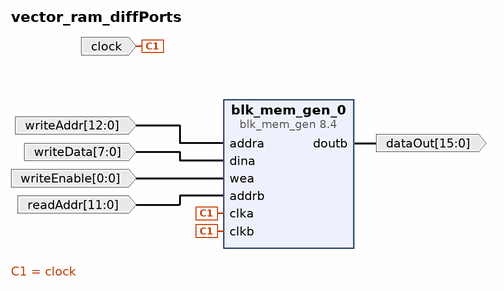
[diagram p0: block diagram of the top level]
# Vivado block design vector_ram_diffPorts, xc7a100tcsg324-1, Vivado 2020.2
create_bd_design vector_ram_diffPorts

create_bd_port -dir I -from 12 -to 0 writeAddr
create_bd_port -dir I -from 7 -to 0 writeData
create_bd_port -dir I -from 0 -to 0 writeEnable
create_bd_port -dir I clock
create_bd_port -dir I -from 11 -to 0 readAddr
create_bd_port -dir O -from 15 -to 0 dataOut

create_bd_cell -type ip -vlnv xilinx.com:ip:blk_mem_gen:8.4 blk_mem_gen_0
set_property -dict [list \
  CONFIG.Coe_File ../../../../../../../avg_clean2.coe \
  CONFIG.Enable_32bit_Address false \
  CONFIG.Enable_A Always_Enabled \
  CONFIG.Enable_B Always_Enabled \
  CONFIG.Fill_Remaining_Memory_Locations true \
  CONFIG.Load_Init_File true \
  CONFIG.Memory_Type Simple_Dual_Port_RAM \
  CONFIG.Operating_Mode_A NO_CHANGE \
  CONFIG.Port_B_Clock 100 \
  CONFIG.Port_B_Enable_Rate 100 \
  CONFIG.Read_Width_B 16 \
  CONFIG.Register_PortB_Output_of_Memory_Primitives true \
  CONFIG.Use_Byte_Write_Enable false \
  CONFIG.Write_Depth_A 8192 \
  CONFIG.Write_Width_A 8 \
  CONFIG.Write_Width_B 16 \
  CONFIG.use_bram_block Stand_Alone \
] [get_bd_cells blk_mem_gen_0]

# ---- connections ----

connect_bd_net [get_bd_ports writeAddr] [get_bd_pins blk_mem_gen_0/addra]
connect_bd_net [get_bd_ports writeData] [get_bd_pins blk_mem_gen_0/dina]
connect_bd_net [get_bd_ports writeEnable] [get_bd_pins blk_mem_gen_0/wea]
connect_bd_net [get_bd_ports clock] [get_bd_pins blk_mem_gen_0/clka] [get_bd_pins blk_mem_gen_0/clkb]
connect_bd_net [get_bd_ports readAddr] [get_bd_pins blk_mem_gen_0/addrb]
connect_bd_net [get_bd_pins blk_mem_gen_0/doutb] [get_bd_ports dataOut]

validate_bd_design
save_bd_design
